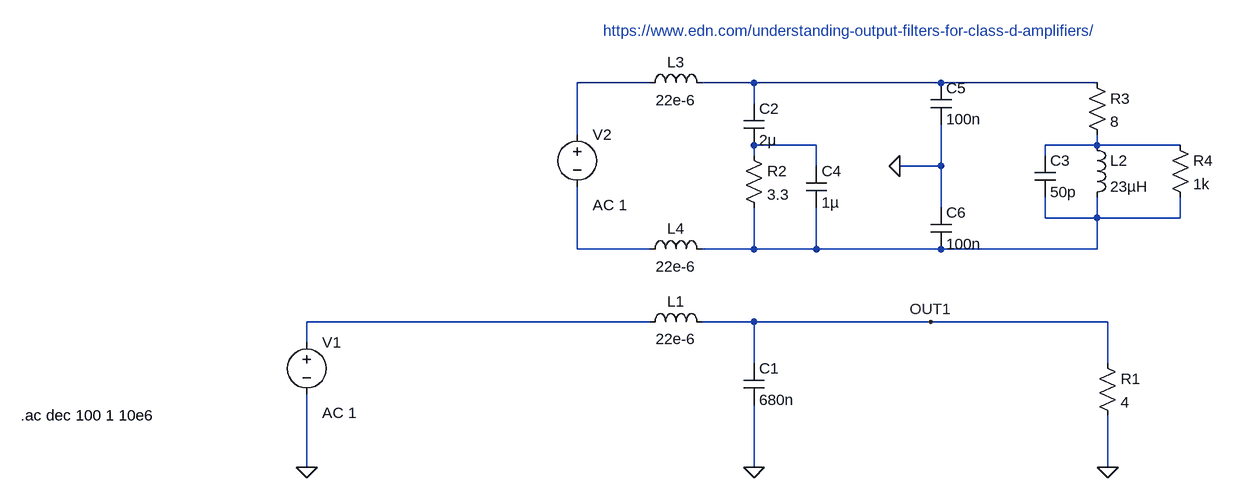
[diagram p0: schematic ClassDfilter.asc]
ClassDfilter.asc, the LTspice schematic file:
Version 4
SHEET 1 1464 680
WIRE 592 -304 480 -304
WIRE 752 -304 672 -304
WIRE 1040 -304 752 -304
WIRE 1280 -304 1040 -304
WIRE 752 -272 752 -304
WIRE 480 -224 480 -304
WIRE 848 -208 752 -208
WIRE 1280 -208 1280 -224
WIRE 1280 -208 1200 -208
WIRE 1408 -208 1280 -208
WIRE 752 -192 752 -208
WIRE 1200 -192 1200 -208
WIRE 848 -176 848 -208
WIRE 1040 -176 1040 -240
WIRE 1040 -176 976 -176
WIRE 1040 -112 1040 -176
WIRE 1200 -96 1200 -128
WIRE 1280 -96 1280 -128
WIRE 1280 -96 1200 -96
WIRE 1408 -96 1408 -128
WIRE 1408 -96 1280 -96
WIRE 480 -48 480 -144
WIRE 592 -48 480 -48
WIRE 752 -48 752 -112
WIRE 752 -48 672 -48
WIRE 848 -48 848 -112
WIRE 848 -48 752 -48
WIRE 1040 -48 848 -48
WIRE 1280 -48 1280 -96
WIRE 1280 -48 1040 -48
WIRE 592 64 64 64
WIRE 752 64 672 64
WIRE 1024 64 752 64
WIRE 1296 64 1024 64
WIRE 64 96 64 64
WIRE 752 128 752 64
WIRE 1296 128 1296 64
WIRE 64 288 64 176
WIRE 752 288 752 192
WIRE 1296 288 1296 208
FLAG 64 288 0
FLAG 752 288 0
FLAG 1296 288 0
FLAG 1024 64 OUT1
FLAG 976 -176 0
SYMBOL voltage 64 80 R0
WINDOW 123 24 124 Left 2
WINDOW 39 0 0 Left 0
SYMATTR Value2 AC 1
SYMATTR InstName V1
SYMATTR Value ""
SYMBOL res 1264 -320 R0
SYMATTR InstName R3
SYMATTR Value 8
SYMBOL ind 1264 -224 R0
SYMATTR InstName L2
SYMATTR Value 23µH
SYMBOL cap 1184 -192 R0
SYMATTR InstName C3
SYMATTR Value 50p
SYMBOL res 1392 -224 R0
SYMATTR InstName R4
SYMATTR Value 1k
SYMBOL ind 576 80 R270
WINDOW 0 32 56 VTop 2
WINDOW 3 5 56 VBottom 2
SYMATTR InstName L1
SYMATTR Value 22e-6
SYMATTR SpiceLine Rser=0.1
SYMBOL cap 736 128 R0
SYMATTR InstName C1
SYMATTR Value 680n
SYMBOL res 1280 112 R0
SYMATTR InstName R1
SYMATTR Value 4
SYMBOL ind 576 -288 R270
WINDOW 0 32 56 VTop 2
WINDOW 3 5 56 VBottom 2
SYMATTR InstName L3
SYMATTR Value 22e-6
SYMATTR SpiceLine Rser=0.1
SYMBOL cap 736 -272 R0
SYMATTR InstName C2
SYMATTR Value 2µ
SYMBOL res 736 -208 R0
SYMATTR InstName R2
SYMATTR Value 3.3
SYMBOL cap 832 -176 R0
SYMATTR InstName C4
SYMATTR Value 1µ
SYMBOL voltage 480 -240 R0
WINDOW 123 24 124 Left 2
WINDOW 39 0 0 Left 0
SYMATTR Value2 AC 1
SYMATTR InstName V2
SYMATTR Value ""
SYMBOL ind 576 -32 R270
WINDOW 0 32 56 VTop 2
WINDOW 3 5 56 VBottom 2
SYMATTR InstName L4
SYMATTR Value 22e-6
SYMATTR SpiceLine Rser=0.1
SYMBOL cap 1024 -304 R0
SYMATTR InstName C5
SYMATTR Value 100n
SYMBOL cap 1024 -112 R0
SYMATTR InstName C6
SYMATTR Value 100n
TEXT -376 208 Left 2 !.ac dec 100 1 10e6
TEXT 520 -384 Left 2 ;https://www.edn.com/understanding-output-filters-for-class-d-amplifiers/

The netlist it stands for:
* ClassDfilter.asc
V1 N007 0 AC 1
R3 N002 N004 8
L2 N004 N005 23µH
C3 N004 N005 50p
R4 N004 N005 1k
L1 N007 OUT1 22e-6 Rser=0.1
C1 OUT1 0 680n
R1 OUT1 0 4
L3 N001 N002 22e-6 Rser=0.1
C2 N002 N003 2µ
R2 N003 N005 3.3
C4 N003 N005 1µ
V2 N001 N006 AC 1
L4 N006 N005 22e-6 Rser=0.1
C5 N002 0 100n
C6 0 N005 100n
.ac dec 100 1 10e6
* https://www.edn.com/understanding-output-filters-for-class-d-amplifiers/
.backanno
.end